# EAGLE schematic Headlightsv4 (EAGLE 7.6.0)
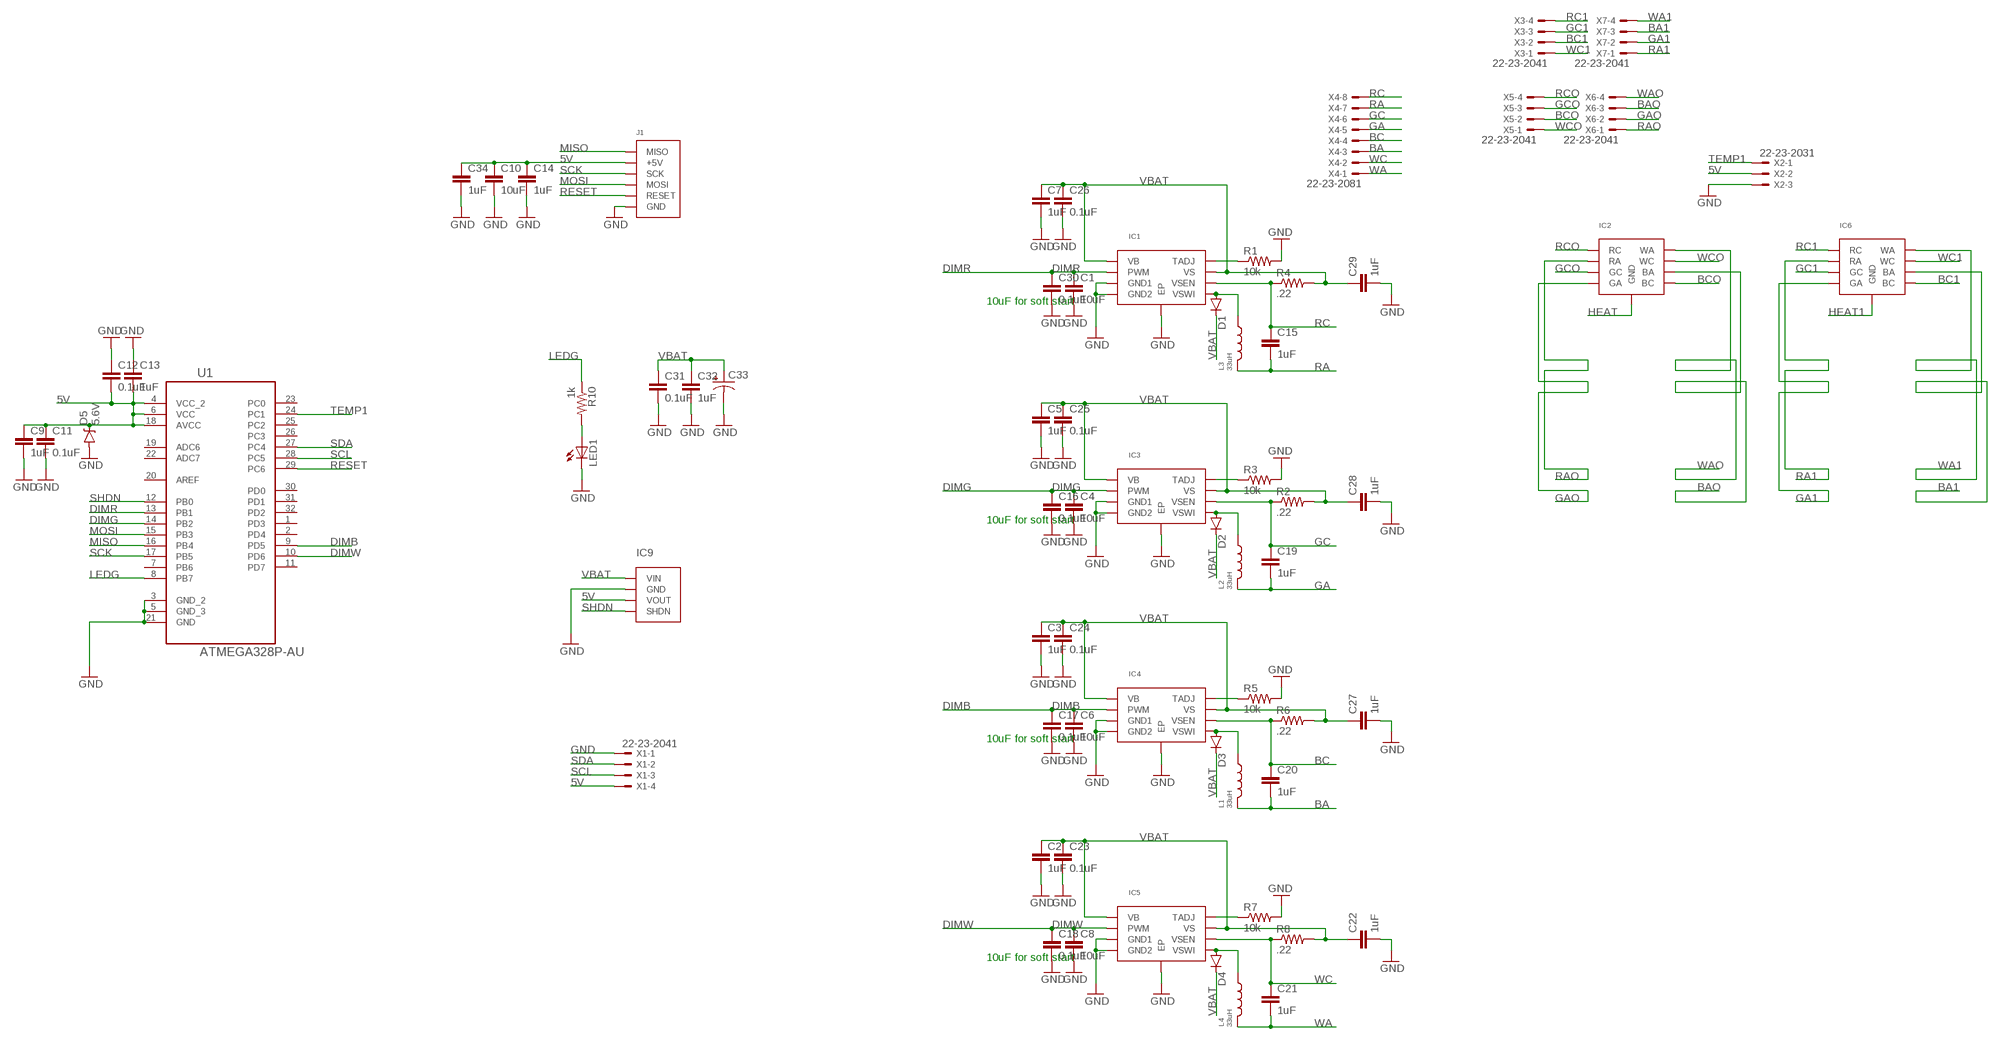
[diagram p0: schematic, sheet 1]

## Parts
C1  10uF  10UF10V10%(0805)  [0805-CAP]
C2  1uF  0.33UF-50V-10%(0805)  [0805-CAP]
C3  1uF  0.33UF-50V-10%(0805)  [0805-CAP]
C4  10uF  10UF10V10%(0805)  [0805-CAP]
C5  1uF  0.33UF-50V-10%(0805)  [0805-CAP]
C6  10uF  10UF10V10%(0805)  [0805-CAP]
C7  1uF  0.33UF-50V-10%(0805)  [0805-CAP]
C8  10uF  10UF10V10%(0805)  [0805-CAP]
C9  1uF  0.33UF-50V-10%(0805)  [0805-CAP]
C10  10uF  10UF10V10%(0805)  [0805-CAP]
C11  0.1uF  0.33UF-50V-10%(0805)  [0805-CAP]
C12  0.1uF  0.33UF-50V-10%(0805)  [0805-CAP]
C13  1uF  0.33UF-50V-10%(0805)  [0805-CAP]
C14  1uF  0.33UF-50V-10%(0805)  [0805-CAP]
C15  1uF  0.33UF-50V-10%(0805)  [0805-CAP]
C16  0.1uF  0.33UF-50V-10%(0805)  [0805-CAP]
C17  0.1uF  0.33UF-50V-10%(0805)  [0805-CAP]
C18  0.1uF  0.33UF-50V-10%(0805)  [0805-CAP]
C19  1uF  0.33UF-50V-10%(0805)  [0805-CAP]
C20  1uF  0.33UF-50V-10%(0805)  [0805-CAP]
C21  1uF  0.33UF-50V-10%(0805)  [0805-CAP]
C22  1uF  0.33UF-50V-10%(0805)  [0805-CAP]
C23  0.1uF  0.33UF-50V-10%(0805)  [0805-CAP]
C24  0.1uF  0.33UF-50V-10%(0805)  [0805-CAP]
C25  0.1uF  0.33UF-50V-10%(0805)  [0805-CAP]
C26  0.1uF  0.33UF-50V-10%(0805)  [0805-CAP]
C27  1uF  0.33UF-50V-10%(0805)  [0805-CAP]
C28  1uF  0.33UF-50V-10%(0805)  [0805-CAP]
C29  1uF  0.33UF-50V-10%(0805)  [0805-CAP]
C30  0.1uF  0.33UF-50V-10%(0805)  [0805-CAP]
C31  0.1uF  0.33UF-50V-10%(0805)  [0805-CAP]
C32  1uF  0.33UF-50V-10%(0805)  [0805-CAP]
C33  CAP_POLF80  [NIPPON_F80]
C34  1uF  0.33UF-50V-10%(0805)  [0805-CAP]
D1  DIODESMA-ALT  [SMA-DIODE_ALT]
D2  DIODESMA-ALT  [SMA-DIODE_ALT]
D3  DIODESMA-ALT  [SMA-DIODE_ALT]
D4  DIODESMA-ALT  [SMA-DIODE_ALT]
D5  5.6V  DIODE-ZENER5.6V  [SOD-323]
IC1  ILD6150_LED_DRIVER  [PG-DSO-8-27]
IC2  LED_RGBW_CONF2  [LED_RGBW_CUSTOM]
IC3  ILD6150_LED_DRIVER  [PG-DSO-8-27]
IC4  ILD6150_LED_DRIVER  [PG-DSO-8-27]
IC5  ILD6150_LED_DRIVER  [PG-DSO-8-27]
IC6  LED_RGBW_CONF2  [LED_RGBW_CUSTOM]
IC9  5VBUCK_DANNY_CUSTOM_PCB  [4PIN_.1']
J1  ISPHEADER  [2X3PIN_.1']
L1  33uH  CHIP_IND  [8X8MM_IND]
L2  33uH  CHIP_IND  [8X8MM_IND]
L3  33uH  CHIP_IND  [8X8MM_IND]
L4  33uH  CHIP_IND  [8X8MM_IND]
LED1  LEDCHIPLED_0805  [CHIPLED_0805]
R1  10k  0.3OHM-1/8W-1%(0805)  [0805]
R2  .22  RESISTOR1206  [1206]
R3  10k  0.3OHM-1/8W-1%(0805)  [0805]
R4  .22  RESISTOR1206  [1206]
R5  10k  0.3OHM-1/8W-1%(0805)  [0805]
R6  .22  RESISTOR1206  [1206]
R7  10k  0.3OHM-1/8W-1%(0805)  [0805]
R8  .22  RESISTOR1206  [1206]
R10  1k  0.3OHM-1/8W-1%(0805)  [0805]
U1  ATMEGA328P-AU  [QFP80P900X900X120-32N]
X1  22-23-2041  [22-23-2041]
X2  22-23-2031  [22-23-2031]
X3  22-23-2041  [22-23-2041]
X4  22-23-2081  [22-23-2081]
X5  22-23-2041  [22-23-2041]
X6  22-23-2041  [22-23-2041]
X7  22-23-2041  [22-23-2041]

## Nets
5V: C9.1 C10.1 C11.1 C12.2 C13.2 C14.1 C34.1 D5.C IC9.P$3(VOUT) J1.P$2(+5V) U1.4(VCC_2) U1.6(VCC) U1.18(AVCC) X1.4 X2.2
BA: C20.2 L1.P$1 X4.3
BA1: IC6.6(BA) X7.3
BAO: IC2.6(BA) X6.3
BC: C20.1 IC4.P$6(VSEN) R6.1 X4.4
BC1: IC6.5(BC) X3.2
BCO: IC2.5(BC) X5.2
DIMB: C6.1 C17.1 IC4.P$2(PWM) U1.9(PD5)
DIMG: C4.1 C16.1 IC3.P$2(PWM) U1.14(PB2)
DIMR: C1.1 C30.1 IC1.P$2(PWM) U1.13(PB1)
DIMW: C8.1 C18.1 IC5.P$2(PWM) U1.10(PD6)
GA: C19.2 L2.P$1 X4.5
GA1: IC6.4(GA) X7.2
GAO: IC2.4(GA) X6.2
GC: C19.1 IC3.P$6(VSEN) R2.1 X4.6
GC1: IC6.3(GC) X3.3
GCO: IC2.3(GC) X5.3
GND: C1.2 C2.2 C3.2 C4.2 C5.2 C6.2 C7.2 C8.2 C9.2 C10.2 C11.2 C12.1 C13.1 C14.2 C16.2 C17.2 C18.2 C22.2 C23.2 C24.2 C25.2 C26.2 C27.2 C28.2 C29.2 C30.2 C31.2 C32.2 C33.- C34.2 D5.A IC1.P$3(GND1) IC1.P$4(GND2) IC1.P$9(EP) IC3.P$3(GND1) IC3.P$4(GND2) IC3.P$9(EP) IC4.P$3(GND1) IC4.P$4(GND2) IC4.P$9(EP) IC5.P$3(GND1) IC5.P$4(GND2) IC5.P$9(EP) IC9.P$2(GND) J1.P$6(GND) LED1.C R1.2 R3.2 R5.2 R7.2 U1.3(GND_2) U1.5(GND_3) U1.21(GND) X1.1 X2.3
HEAT: IC2.9(GND)
HEAT1: IC6.9(GND)
LEDG: R10.1 U1.8(PB7)
MISO: J1.P$1(MISO) U1.16(PB4)
MOSI: J1.P$4(MOSI) U1.15(PB3)
N$1: IC1.P$8(TADJ) R1.1
N$2: IC3.P$8(TADJ) R3.1
N$3: D2.A IC3.P$5(VSWI) L2.P$2
N$4: IC4.P$8(TADJ) R5.1
N$5: D1.A IC1.P$5(VSWI) L3.P$2
N$6: D3.A IC4.P$5(VSWI) L1.P$2
N$7: IC5.P$8(TADJ) R7.1
N$8: D4.A IC5.P$5(VSWI) L4.P$2
N$19: LED1.A R10.2
RA: C15.2 L3.P$1 X4.7
RA1: IC6.2(RA) X7.1
RAO: IC2.2(RA) X6.1
RC: C15.1 IC1.P$6(VSEN) R4.1 X4.8
RC1: IC6.1(RC) X3.4
RCO: IC2.1(RC) X5.4
RESET: J1.P$5(RESET) U1.29(PC6)
SCK: J1.P$3(SCK) U1.17(PB5)
SCL: U1.28(PC5) X1.3
SDA: U1.27(PC4) X1.2
SHDN: IC9.P$4(SHDN) U1.12(PB0)
TEMP1: U1.24(PC1) X2.1
VBAT: C2.1 C3.1 C5.1 C7.1 C22.1 C23.1 C24.1 C25.1 C26.1 C27.1 C28.1 C29.1 C31.1 C32.1 C33.+ D1.C D2.C D3.C D4.C IC1.P$1(VB) IC1.P$7(VS) IC3.P$1(VB) IC3.P$7(VS) IC4.P$1(VB) IC4.P$7(VS) IC5.P$1(VB) IC5.P$7(VS) IC9.P$1(VIN) R2.2 R4.2 R6.2 R8.2
WA: C21.2 L4.P$1 X4.1
WA1: IC6.8(WA) X7.4
WAO: IC2.8(WA) X6.4
WC: C21.1 IC5.P$6(VSEN) R8.1 X4.2
WC1: IC6.7(WC) X3.1
WCO: IC2.7(WC) X5.1
Unconnected: U1.1(PD3) U1.2(PD4) U1.7(PB6) U1.11(PD7) U1.19(ADC6) U1.20(AREF) U1.22(ADC7) U1.23(PC0) U1.25(PC2) U1.26(PC3) U1.30(PD0) U1.31(PD1) U1.32(PD2)

## Notes on the sheet
- 10uF for soft start
- 10uF for soft start
- 10uF for soft start
- 10uF for soft start

## Library data of the parts
C1 C4 C6 C8 C10 = SparkFun-Capacitors:10UF10V10%(0805): CAP-11330; PROD_ID: CAP-11330
C2 C3 C5 C7 C9 C11-C32 C34 = SparkFun-Capacitors:0.33UF-50V-10%(0805): CAP-08469; PROD_ID: CAP-08469; VALUE: 0.33uF
C33 = SparkFun-Capacitors:CAP_POL: Capacitor Polarized These are standard SMD and PTH capacitors. Normally 10uF, 47uF, and 100uF in electrolytic and tantalum varieties. Always verify the external diameter of the through hole cap, it varies with capacity, voltage, and manufacturer. The EIA devices should be standard.
D1-D4 = SparkFun-DiscreteSemi:DIODE: Diode These are standard reverse protection diodes and small signal diodes. SMA package can handle up to about 1A. SOD-323 can handle about 200mA. What the SOD-323 package when ordering, there are some mfgs out there that are 5-pin packages.
D5 = SparkFun-DiscreteSemi:DIODE-ZENER: Zener Diode Production Part - 8199 3.4V Zener Voltage; PROD_ID: DIO-12442
IC1 IC3-IC5 = lolomolo:ILD6150_LED_DRIVER
IC2 IC6 = lolomolo:LED_RGBW_CONF2
IC9 = lolomolo:5VBUCK_DANNY_CUSTOM_PCB
J1 = lolomolo:ISPHEADER
L1-L4 = lolomolo:CHIP_IND: Chip Inductor
LED1 = adafruit:LED: LED OSRAM: - CHIPLED LG R971, LG N971, LY N971, LG Q971, LY Q971, LO R971, LY R971 LH N974, LH R974 LS Q976, LO Q976, LY Q976 LO Q996 - Hyper CHIPLED LW Q18S LB Q993, LB Q99A, LB R99A - SideLED LS A670, LO A670, LY A670, LG A670, LP A670 LB A673, LV A673, LT A673, LW A673 LH A674 LY A675 LS A676, LA A676, LO A676, LY A676, LW A676 LS A679, LY A679, LG A679 - Hyper Micro SIDELED® LS Y876, LA Y876, LO Y876, LY Y876 LT Y87S - SmartLED LW L88C, LW L88S LB L89C, LB L89S, LG L890 LS L89K, LO L89K, LY L89K LS L896, LA L896, LO L896, LY L896 - TOPLED LS T670, LO T670, LY T670, LG T670, LP T670 LSG T670, LSP T670, LSY T670, LOP T670, LYG T670 LG T671, LOG T671, LSG T671 LB T673, LV T673, LT T673, LW T673 LH T674 LS T676, LA T676, LO T676, LY T676, LB T676, LH T676, LSB T676, LW T676 LB T67C, LV T67C, LT T67C, LS T67K, LO T67K, LY T67K, LW E67C LS E67B, LA E67B, LO E67B, LY E67B, LB E67C, LV E67C, LT E67C LW T67C LS T679, LY T679, LG T679 LS T770, LO T770, LY T770, LG T770, LP T770 LB T773, LV T773, LT T773, LW T773 LH T774 LS E675, LA E675, LY E675, LS T675 LS T776, LA T776, LO T776, LY T776, LB T776 LHGB T686 LT T68C, LB T68C - Hyper Mini TOPLED® LB M676 - Mini TOPLED Santana® LG M470 LS M47K, LO M47K, LY M47K Source: http://www.osram.convergy.de/
R1 R3 R5 R7 R10 = SparkFun-Resistors:0.3OHM-1/8W-1%(0805): RES-11622; PROD_ID: RES-11622; VALUE: 0.3
R2 R4 R6 R8 = SparkFun-Passives:RESISTOR: Resistor Basic schematic elements and footprints for 0603, 1206, and PTH resistors.
U1 = Atmel_By_element14_Batch_1-00:ATMEGA328P-AU: 8-bit Microcontroller with In-System Programmable Flash; MPN: ATMEGA328P-AU; OC_FARNELL: 1715486; OC_NEWARK: 14R4631; PACKAGE: TQFP-32; SUPPLIER: Atmel
X1 X3 X5-X7 = con-molex:22-23-2041: .100" (2.54mm) Center Header - 4 Pin; MF: MOLEX; MPN: 22-23-2041; OC_FARNELL: 1462920; OC_NEWARK: 38C0355
X2 = con-molex:22-23-2031: .100" (2.54mm) Center Header - 3 Pin; MF: MOLEX; MPN: 22-23-2031; OC_FARNELL: 1462950; OC_NEWARK: 30C0862
X4 = con-molex:22-23-2081: .100" (2.54mm) Center Header - 8 Pin; MF: MOLEX; MPN: 22-23-2081; OC_FARNELL: 1756826; OC_NEWARK: 01C7592